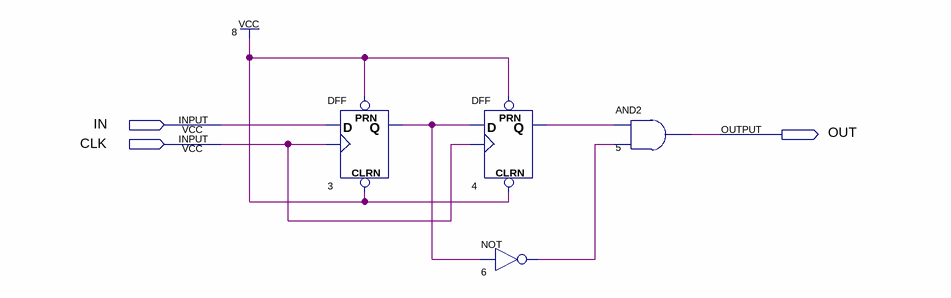
[diagram p0: schematic sheet]
// Quartus schematic waveform.bdf as structural Verilog: 4 symbols, 3 pins
module waveform (
  input  IN,
  input  CLK,
  output OUT
);

  wire n3_q, n4_q, n6_out;

  DFF u_3 (.CLRN(1'b1), .CLK(CLK), .D(IN), .PRN(1'b1), .Q(n3_q));
  DFF u_4 (.CLRN(1'b1), .CLK(CLK), .D(n3_q), .PRN(1'b1), .Q(n4_q));
  not u_6 (n6_out, n3_q);
  and u_5 (OUT, n4_q, n6_out);
endmodule
